# Altium schematic sheet Connectivity.SchDoc: =@Title
size A3; Author: Paulo Peixoto; DrawnBy: Paulo Peixoto; Engineer: Paulo Peixoto; SheetNumber: 3; SheetTotal: 5
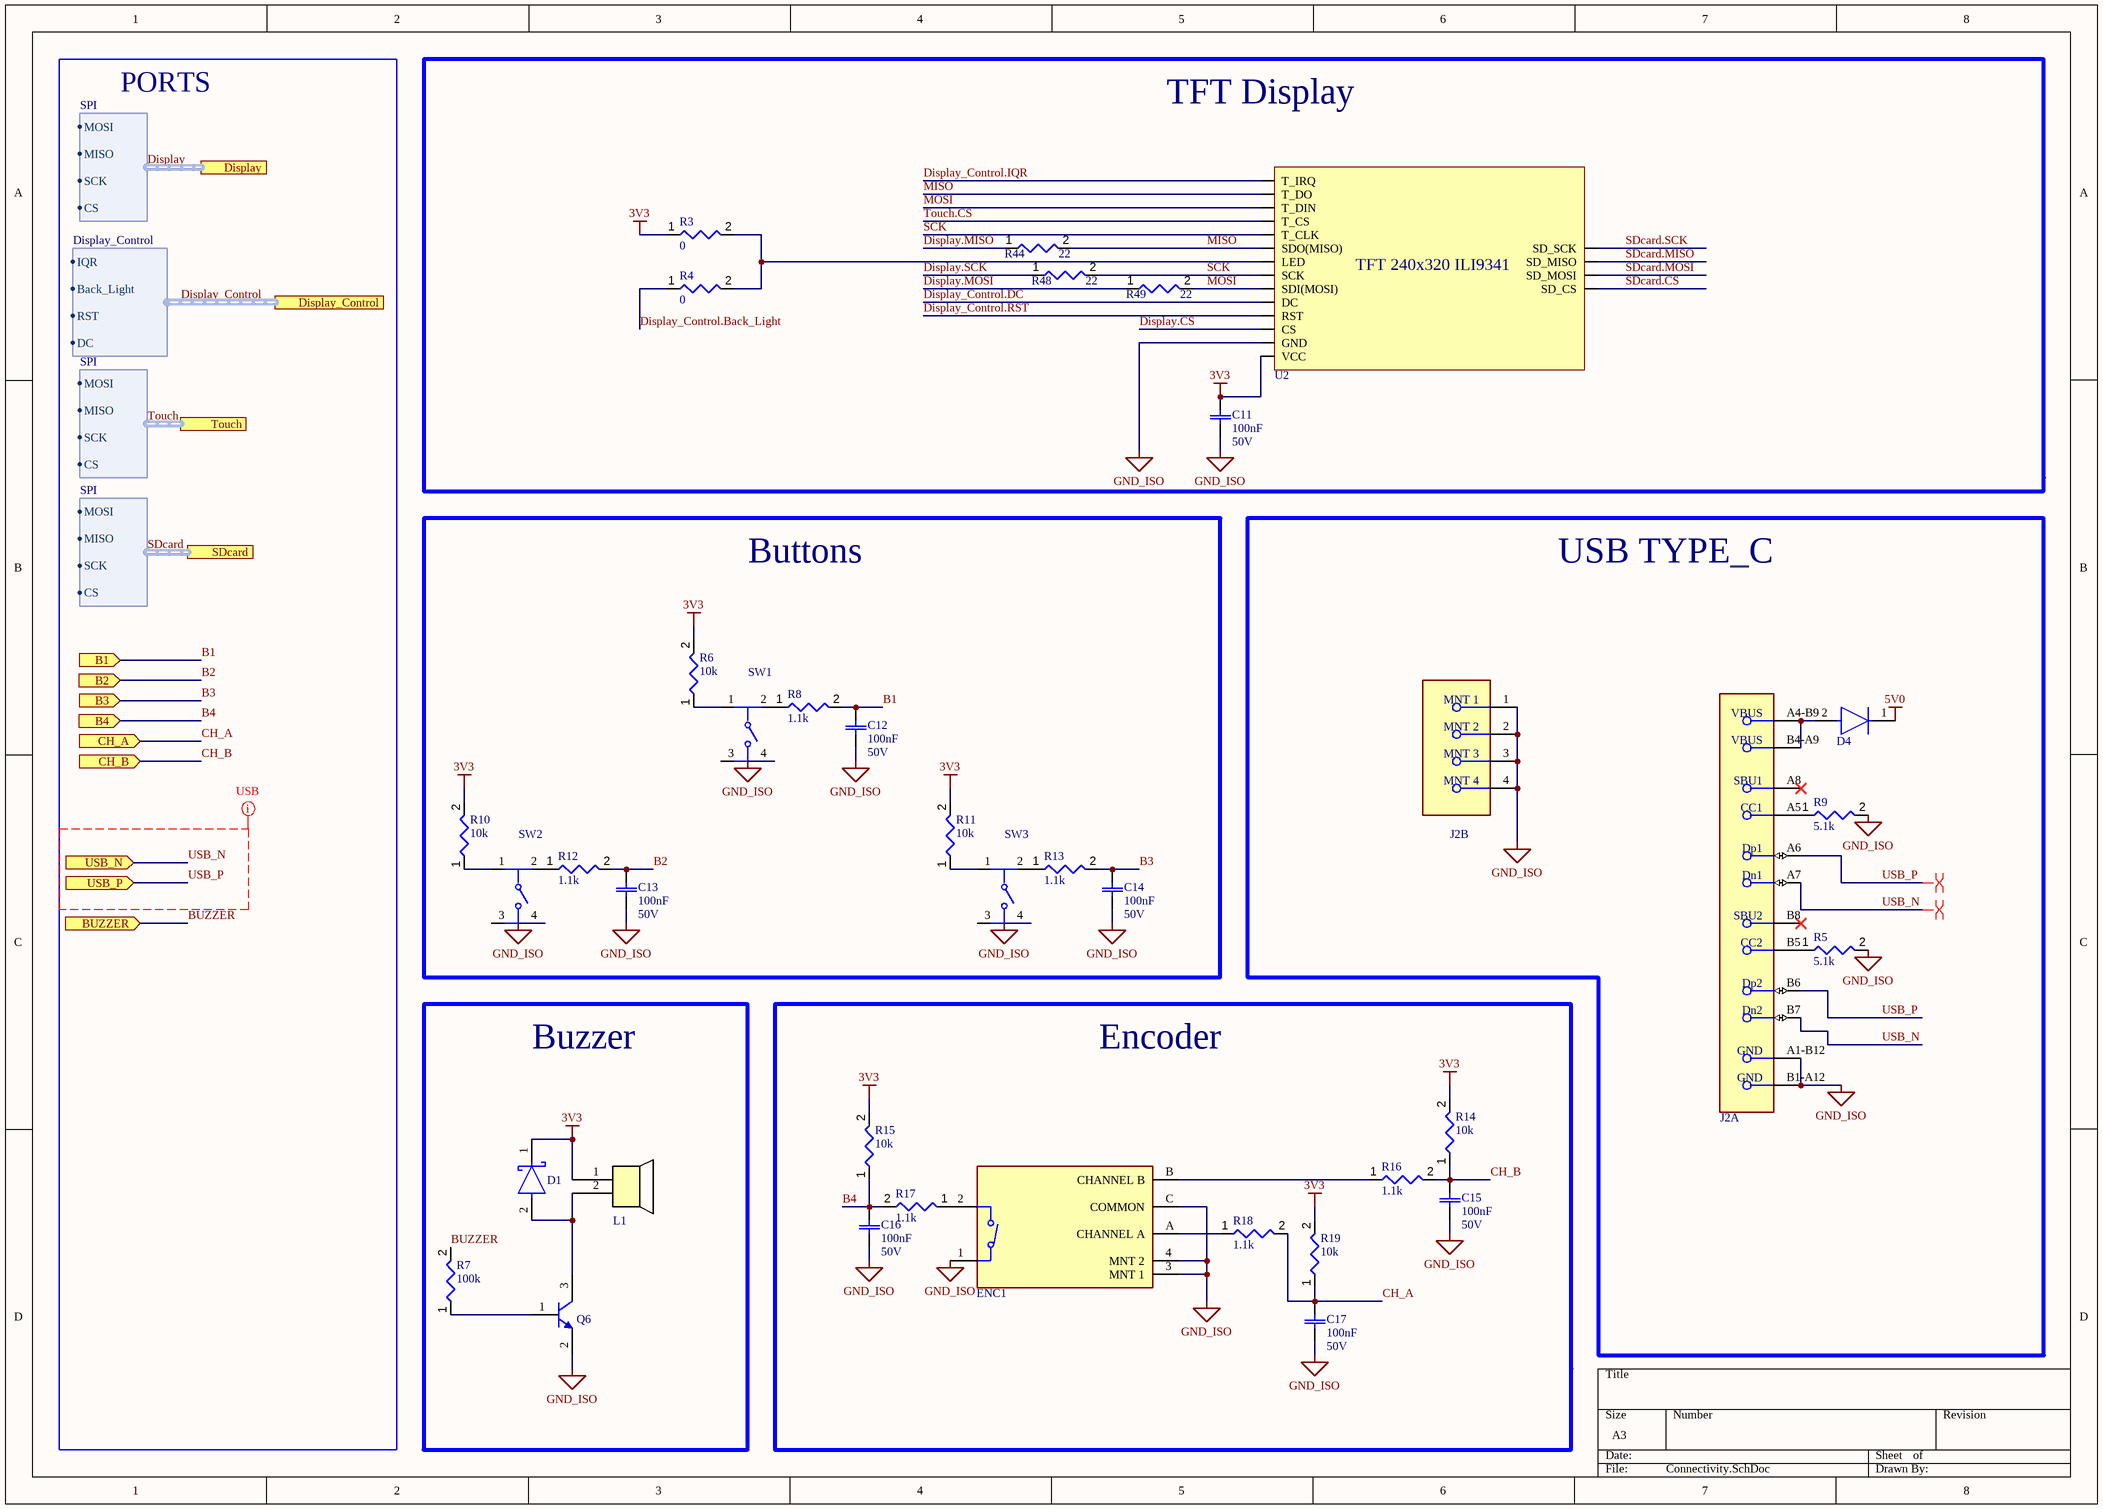
[diagram p0: Connectivity.SchDoc]

## Parts
C11  value 100nF  Voltage Rating: 50V  [Generic Ceramic 0603 CAP]  (hidden comment: CAP-MLCC_SMD-0603_MR-GCM_u_0.1uF_50V_10%_X8L)
C12  value 100nF  Voltage Rating: 50V  [Generic Ceramic 0603 CAP]  (hidden comment: CAP-MLCC_SMD-0603_MR-GCM_u_0.1uF_50V_10%_X8L)
C13  value 100nF  Voltage Rating: 50V  [Generic Ceramic 0603 CAP]  (hidden comment: CAP-MLCC_SMD-0603_MR-GCM_u_0.1uF_50V_10%_X8L)
C14  value 100nF  Voltage Rating: 50V  [Generic Ceramic 0603 CAP]  (hidden comment: CAP-MLCC_SMD-0603_MR-GCM_u_0.1uF_50V_10%_X8L)
C15  value 100nF  Voltage Rating: 50V  [Generic Ceramic 0603 CAP]  (hidden comment: CAP-MLCC_SMD-0603_MR-GCM_u_0.1uF_50V_10%_X8L)
C16  value 100nF  Voltage Rating: 50V  [Generic Ceramic 0603 CAP]  (hidden comment: CAP-MLCC_SMD-0603_MR-GCM_u_0.1uF_50V_10%_X8L)
C17  value 100nF  Voltage Rating: 50V  [Generic Ceramic 0603 CAP]  (hidden comment: CAP-MLCC_SMD-0603_MR-GCM_u_0.1uF_50V_10%_X8L)
D1  DIO-SHOTTKY_SMD_OD-214AC_TWS-1A_100V  [DIO-SHOTTKY_SMD_OD-214AC_TWS-1A_100V-Footprint-1]  (value not drawn)
D4  RS1A  [FP-403AE-MFG]  (value not drawn)
ENC1  PEC11R-4020F-S0012  [FP-PEC11R-4020F-S0012-MFG]  (value not drawn)
J2  217179-0001  [FP-2171790001-MFG]  (value not drawn)  (parts A,B of 2)
L1  TMB12A05  [TMB12A05-Footprint-1]  (value not drawn)
Q6  SMMBT2222ALT1G  [ONSC-SOT-23-3-318-08_V]  (value not drawn)
R3  value 0  [Generic_0603_RES]  (hidden comment: RES-TK_SMD-0603_VIS-CRCW_R_0R_1/10W_1%)
R4  value 0  [Generic_0603_RES]  (hidden comment: RES-TK_SMD-0603_VIS-CRCW_R_0R_1/10W_1%)
R5  value 5.1k  [Generic_0603_RES]  (hidden comment: RES-TK_SMD-0603_VIS-CRCW_K_5.1K_1/10W_1%)
R6  value 10k  [Generic_0603_RES]  (hidden comment: RES-TK_SMD-0603_VIS-CRCW_K_10K_1/10W_1%)
R7  value 100k  [Generic_0603_RES]  (hidden comment: RES-TK_SMD-0603_VIS-CRCW_K_100K_1/10W_1%)
R8  value 1.1k  [Generic_0603_RES]  (hidden comment: RES-TK_SMD-0603_VIS-CRCW_K_1.1K_1/10W_1%)
R9  value 5.1k  [Generic_0603_RES]  (hidden comment: RES-TK_SMD-0603_VIS-CRCW_K_5.1K_1/10W_1%)
R10  value 10k  [Generic_0603_RES]  (hidden comment: RES-TK_SMD-0603_VIS-CRCW_K_10K_1/10W_1%)
R11  value 10k  [Generic_0603_RES]  (hidden comment: RES-TK_SMD-0603_VIS-CRCW_K_10K_1/10W_1%)
R12  value 1.1k  [Generic_0603_RES]  (hidden comment: RES-TK_SMD-0603_VIS-CRCW_K_1.1K_1/10W_1%)
R13  value 1.1k  [Generic_0603_RES]  (hidden comment: RES-TK_SMD-0603_VIS-CRCW_K_1.1K_1/10W_1%)
R14  value 10k  [Generic_0603_RES]  (hidden comment: RES-TK_SMD-0603_VIS-CRCW_K_10K_1/10W_1%)
R15  value 10k  [Generic_0603_RES]  (hidden comment: RES-TK_SMD-0603_VIS-CRCW_K_10K_1/10W_1%)
R16  value 1.1k  [Generic_0603_RES]  (hidden comment: RES-TK_SMD-0603_VIS-CRCW_K_1.1K_1/10W_1%)
R17  value 1.1k  [Generic_0603_RES]  (hidden comment: RES-TK_SMD-0603_VIS-CRCW_K_1.1K_1/10W_1%)
R18  value 1.1k  [Generic_0603_RES]  (hidden comment: RES-TK_SMD-0603_VIS-CRCW_K_1.1K_1/10W_1%)
R19  value 10k  [Generic_0603_RES]  (hidden comment: RES-TK_SMD-0603_VIS-CRCW_K_10K_1/10W_1%)
R44  value 22  [Generic_0603_RES]  (hidden comment: RES-TK_SMD-0603_VIS-CRCW_R_22R_1/10W_1%)
R48  value 22  [Generic_0603_RES]  (hidden comment: RES-TK_SMD-0603_VIS-CRCW_R_22R_1/10W_1%)
R49  value 22  [Generic_0603_RES]  (hidden comment: RES-TK_SMD-0603_VIS-CRCW_R_22R_1/10W_1%)
SW1  TL1105AF160Q  [FP-TL1105AF160Q-MFG]  (value not drawn)
SW2  TL1105AF160Q  [FP-TL1105AF160Q-MFG]  (value not drawn)
SW3  TL1105AF160Q  [FP-TL1105AF160Q-MFG]  (value not drawn)
U2  TFT 240x320 SPI  [TFT ILI9341 2.4inch]  (value not drawn)

## Blocks framed on the sheet
TFT Display: C11 R3 R4 R44 R48 R49 U2
Buttons: C12-C14 R6 R8 R10-R13 SW1-SW3
USB TYPE_C: D4 J2 R5 R9
Buzzer: D1 L1 Q6 R7
Encoder: C15-C17 ENC1 R14-R19

## Ports
B1 (in, see 1[4B], 2[1C]), B2 (in, see 1[4B], 2[1C]), B3 (in, see 1[4B], 2[1C]), B4 (in, see 1[4A], 2[1C]), BUZZER (in, see 1[4B], 2[1D]), CH_A (in, see 1[4A], 2[1C]), CH_B (in, see 1[4A], 2[1C]), Display (harness SPI, see 1[5B], 2[1A]), Display_Control (harness Display_Control, see 1[5B], 2[1B]), SDcard (harness SPI, see 1[5B], 2[1C]), Touch (harness SPI, see 1[5B], 2[1B]), USB_N (in, see 1[4A], 2[1D]), USB_P (in, see 1[4A], 2[1D])

## Harnesses
SPI: MOSI, MISO, SCK, CS
Display_Control: IQR, Back_Light, RST, DC

## Nets
3V3: C11.2 D1.1(C) L1.1 R3.1 R6.2 R10.2 R11.2 R14.2 R15.2 R19.2 U2.1(VCC)
5V0: D4.1(C)
GND_ISO: C11.1 C12.1 C13.1 C14.1 C15.1 C16.1 C17.1 ENC1.1 ENC1.3(MNT_1) ENC1.4(MNT_2) ENC1.C(COMMON) J2.1(MNT_1) J2.2(MNT_2) J2.3(MNT_3) J2.4(MNT_4) J2.A1-B12(GND) J2.B1-A12(GND) Q6.2(E) R5.2 R9.2 SW1.4 SW2.4 SW3.4 U2.2(GND)
B1: C12.2 R8.2 ; port B1
B2: C13.2 R12.2 ; port B2
B3: C14.2 R13.2 ; port B3
B4: C16.2 R15.1 R17.2 ; port B4
BUZZER: R7.2 ; port BUZZER
CH_A: C17.2 R18.2 R19.1 ; port CH_A
CH_B: C15.2 R14.1 R16.2 ; port CH_B
Display.CS: U2.3(CS)
Display.MISO: R44.1
Display.MOSI: R49.1
Display.SCK: R48.1
Display_Control.Back_Light: R4.1
Display_Control.DC: U2.5(DC)
Display_Control.IQR: U2.14(T_IRQ)
Display_Control.RST: U2.4(RST)
MISO: R44.2 U2.9(SDO(MISO)) U2.13(T_DO)
MOSI: R49.2 U2.6(SDI(MOSI)) U2.12(T_DIN)
SCK: R48.2 U2.7(SCK) U2.10(T_CLK)
SDcard.CS: U2.18(SD_CS)
SDcard.MISO: U2.16(SD_MISO)
SDcard.MOSI: U2.17(SD_MOSI)
SDcard.SCK: U2.15(SD_SCK)
Touch.CS: U2.11(T_CS)
USB_N: J2.A7(Dn1) J2.B7(Dn2) ; port USB_N
USB_P: J2.A6(Dp1) J2.B6(Dp2) ; port USB_P
NetD1_2: D1.2(A) L1.2 Q6.3(C)
NetD4_2: D4.2(A) J2.A4-B9(VBUS) J2.B4-A9(VBUS)
NetENC1_2: ENC1.2 R17.1
NetENC1_A: ENC1.A(CHANNEL_A) R18.1
NetENC1_B: ENC1.B(CHANNEL_B) R16.1
NetJ2_A5: J2.A5(CC1) R9.1
NetJ2_B5: J2.B5(CC2) R5.1
NetQ6_1: Q6.1(B) R7.1
NetR3_2: R3.2 R4.2 U2.8(LED)
NetR6_1: R6.1 SW1.1
NetR8_1: R8.1 SW1.2
NetR10_1: R10.1 SW2.1
NetR11_1: R11.1 SW3.1
NetR12_1: R12.1 SW2.2
NetR13_1: R13.1 SW3.2

Not connected (* = marked no-connect by the designer): J2 A8(SBU1)* B8(SBU2)*; SW1 3; SW2 3; SW3 3

## Buses and harness runs
harness Display = port Display
harness Display_Control = port Display_Control
harness SDcard = port SDcard
harness Touch = port Touch

## Layout directives
differential pair: USB_N, USB_P
net class USB: USB_N, USB_P

## Notes on the sheet
- PORTS
- (in symbol CMP-001-0162-3) TFT 240x320 ILI9341

## Library data of the parts
C11-C17 = CMP-001-00115-11: Ceramic Capacitor, Multilayer, Ceramic, 50V, 10% +Tol, 10% -Tol, X8L, -40/+15% TC, 0.1uF, Surface Mount, 0603; Automotive: AEQ-200; Min Operating Temperature: -55°C; Case/Package: 0603; Mounting Technology: Surface Mount; RoHS Compliant: Yes; Capacitor Type: Ceramic; Pins: 2; Max Operating Temperature: 150°C
D1 = CMP-001-0168-2: Rectifier Diode, Schottky, 1 Phase, 1 Element, 1A, 100V V(RRM), Silicon, DO-214AC; Manufacturer Lifecycle Status: ACTIVE; Manufacturer Part Number: SS110; Peak Reverse Current: 2mA; Peak Non-Repetitive Surge Current: 40A; Element Configuration: Single; Forward Voltage: 800mV; Rep Pk Reverse Voltage-Max: 150V; Number of Elements: 1; Reference Standard: AEC-Q101; Max Repetitive Reverse Voltage (Vrrm): 100V; Mounting Technology: Surface Mount; REACH SVHC: No; Case/Package: SMA; Reach SVHC Compliant: Yes; Max Operating Temperature: 150°C; Height: 2.3mm; Lifecycle Status: Production; Length: 4.6mm; Max Forward Surge Current (Ifsm): 40A; Min Operating Temperature: -55°C; Width: 2.83mm; RoHS Compliant: Yes; Forward Current: 1A; Max Output current: 1A; Reverse Standoff Voltage: 100V; Number of Terminals: 2; RoHS: Compliant; Pins: 2
D4 = CMP-001-0173-1: Diode Fast Recovery Rectifier 50V 1A 2-Pin DO-214AC T/R; Manufacturer Lifecycle Status: ACTIVE; Value: 10pF; Peak Non-Repetitive Surge Current: 30A; Recovery Time: 150ns; Max Power Dissipation: 1.19W; Number of Elements: 1; Polarity: Standard; Forward Voltage: 1.3V; Element Configuration: Single; Peak Reverse Current: 5µA; Max Repetitive Reverse Voltage (Vrrm): 50V; Min Operating Temperature: -55°C; Reverse Standoff Voltage: 50V; Mounting Technology: Surface Mount; Voltage Rating (DC): 50V; Current Rating: 1A; Case/Package: SMA; REACH SVHC: No; Reverse Recovery Time: 150ns; Max Operating Temperature: 150°C; Average Rectified Current: 1A; Radiation Hardening: No; Weight: 106mg; Max Reverse Voltage (DC): 50V; Forward Current: 1A; Length: 4.75mm; Pins: 2; RoHS: Compliant; Lead Free: Lead Free; Width: 2.95mm; Number of Terminals: 2; Output Current: 1A; Max Output current: 1A; Packaging: Cut Tape; China RoHS: Non-Compliant; Power Dissipation: 1.19W; Schedule B: 8541100080, 8541100080; Max Surge Current: 30A; Reverse Voltage: 50V; Height: 2.2mm; Max Forward Surge Current (Ifsm): 30A; Lifecycle Status: Production
ENC1 = CMP-07421-000045-1: ROTARY ENCODER MECHANICAL 12PPR; Built in Switch: Yes; Pulses per Revolution: 12; Number of Channels: 2; Detent: No; Output Type: Quadrature; Min Operating Temperature: -30°C; Height: 13.4mm; Orientation: Vertical; Max Operating Temperature: 70°C; Mount: Through Hole; Termination: PC Pin; Encoder Type: Mechanical; Width: 12.5mm; RoHS Compliant: Yes; Package Quantity: 150; Packaging: Bulk; Length: 26.5mm; Series: PEC11R
J2 = CMP-04767-000028-2: CONN RCP USB2.0 TYP C 24P SMD RA; NexarPartId: 117190526; Gender: Receptacle; Number of Contacts: 16; Current Rating: 1.25A; Voltage Rating: 30V; Min Operating Temperature: -40°C; USB Standard: USB 2.0; Height: 3.36mm; Contact Material: Gold, Nickel; Max Operating Temperature: 85°C
L1 = CMP-001-0165-1: 88dB Active (Built-in Driver Circuit) Electromagnetic Type 2.4kHz Plugin, D=12mm Buzzers ROHS
Q6 = CMP-1048-00591-1: General Purpose Transistor, NPN Silicon, 3-Pin SOT-23, Pb-Free, Tape and Reel; Manufacturer: On Semiconductor; fT Min (MHz): 300; IC Continuous (A): 0.6; Mounting Technology: Surface Mount; ComponentLink1URL: http://www.onsemi.com/; Polarity: NPN; PackageDescription: 3-Pin Small Outline Transistor, Body 2.92 x 1.3 mm, Pitch 0.95 mm; RoHS: TRUE; DatasheetVersion: Rev. 10; Packing: Tape and Reel; PackageVersion: Rev. AP, 11/2009; ComponentLink3Description: Package Specification; PartNumber: SMMBT2222ALT1G; ComponentLink1Description: Manufacturer URL; ComponentLink3URL: http://www.onsemi.cn/pub_link/Collateral/318-08.PDF; PackageReference: SOT-23-3-318-08; ComponentLink2Description: Datasheet; ComponentLink2URL: http://www.onsemi.cn/pub_link/Collateral/MMBT2222LT1-D.PDF
R3 R4 = CMP-009-00217-3: Resistor SMD 0 Ohm 0603 PU=5000 ST, CRCW06030000Z0EA, Vishay; Tolerance: 1%; Voltage Rating: 75V; Power: 100mW; Min Operating Temperature: -55°C; Mounting Technology: Surface Mount; Pins: 2; Max Operating Temperature: 155°C; Case/Package: 0603; RoHS Compliant: Yes
R5 R9 = CMP-009-00305-1: Fixed Resistor, Metal Glaze/thick Film, 0.1W, 5100ohm, 75V, 1% +/-Tol, 100ppm/Cel, Surface Mount, 0603; Power: 100mW; Max Operating Temperature: 155°C; Voltage Rating: 75V; Tolerance: 1%; Min Operating Temperature: -55°C; Pins: 2; Mounting Technology: Surface Mount; RoHS Compliant: Yes; Case/Package: 0603
R6 R10 R11 R14 R15 R19 = CMP-009-00246-1: Fixed Resistor, Metal Glaze/thick Film, 0.1W, 10000ohm, 75V, 1% +/-Tol, 100ppm/Cel, Surface Mount, 0603; Power: 100mW; Mounting Technology: Surface Mount; Pins: 2; Min Operating Temperature: -55°C; Tolerance: 1%; RoHS Compliant: Yes; Max Operating Temperature: 155°C; Case/Package: 0603; Voltage Rating: 75V
R7 = CMP-009-00230-4: Fixed Resistor, Metal Glaze/thick Film, 0.1W, 100000ohm, 75V, 1% +/-Tol, 100ppm/Cel, Surface Mount, 0603; Power: 100mW; Pins: 2; Max Operating Temperature: 155°C; Mounting Technology: Surface Mount; Case/Package: 0603; RoHS Compliant: Yes; Voltage Rating: 75V; Tolerance: 1%; Min Operating Temperature: -55°C
R8 R12 R13 R16-R18 = CMP-009-00235-1: Fixed Resistor, Metal Glaze/thick Film, 0.1W, 1100ohm, 75V, 1% +/-Tol, 100ppm/Cel, Surface Mount, 0603; Power: 100mW; Mounting Technology: Surface Mount; Max Operating Temperature: 155°C; RoHS Compliant: Yes; Min Operating Temperature: -55°C; Voltage Rating: 75V; Case/Package: 0603; Tolerance: 1%; Pins: 2
R44 R48 R49 = CMP-009-00275-2: Res Thick Film 0603 22 Ohm 1% 1/10W ±100ppm/°C Molded SMD Paper T/R; Power: 125mW; Voltage Rating: 75V; Case/Package: 0603; Min Operating Temperature: -55°C; Pins: 2; Max Operating Temperature: 155°C; RoHS Compliant: Yes; Mounting Technology: Surface Mount; Tolerance: 1%
SW1-SW3 = CMP-17879-000016-1: SWITCH TACTILE SPST-NO 0.05A 12V; Mechanical Life: 100000Cycles; Contact Current Rating: 50mA; Contact Resistance: 100mR; Switch Function: Off-Mom; Actuator Type: Standard; Actuator Length: 1.4mm; Max Voltage Rating (DC): 50V; Throw Configuration: SPST; Actuator Material: Nylon; Illumination Type: Non-Illuminated; Switch Travel: 0.25mm; Operating Force: 160gf; Package Quantity: 750; Width: 6mm; Series: TL1105; Voltage Rating (DC): 12V; Length: 6mm; Contact Plating: Silver; Color: Black; Housing Material: Nylon; Min Operating Temperature: -20°C; Lead Free: Lead Free; Mount: Through Hole; Termination: PC Pin; RoHS Compliant: Yes; Orientation: Straight; Max Operating Temperature: 70°C; Reach SVHC Compliant: Yes; Packaging: Bulk; Electrical Life: 100000Cycles; Current Rating: 50mA; Contact Material: Bronze; Size: 6mm
U2 = CMP-001-0162-3